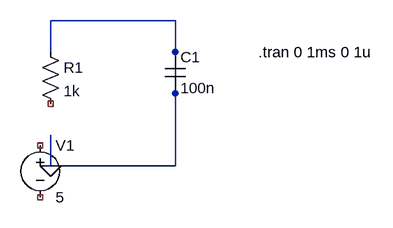
[diagram p0: schematic basic_rc.asc]
basic_rc.asc, the LTspice schematic file:
Version 4
SHEET 1 880 680
WIRE 64 48 64 0
WIRE 64 224 64 176
WIRE 64 224 256 224
WIRE 256 48 256 224
WIRE 64 0 256 0
WIRE 256 0 256 48
FLAG 64 224 0
SYMBOL res 48 32 R0
SYMATTR InstName R1
SYMATTR Value 1k
SYMBOL cap 240 48 R0
SYMATTR InstName C1
SYMATTR Value 100n
SYMBOL voltage 48 176 R0
SYMATTR InstName V1
SYMATTR Value 5
TEXT 384 48 Left 2 !.tran 0 1ms 0 1u

The netlist it stands for:
* basic_rc.asc
R1 0 NC_01 1k
C1 0 0 100n
V1 NC_02 NC_03 5
.tran 0 1ms 0 1u
.backanno
.end